# Altium schematic sheet TinyShuffle v.0b.SchDoc
size A2
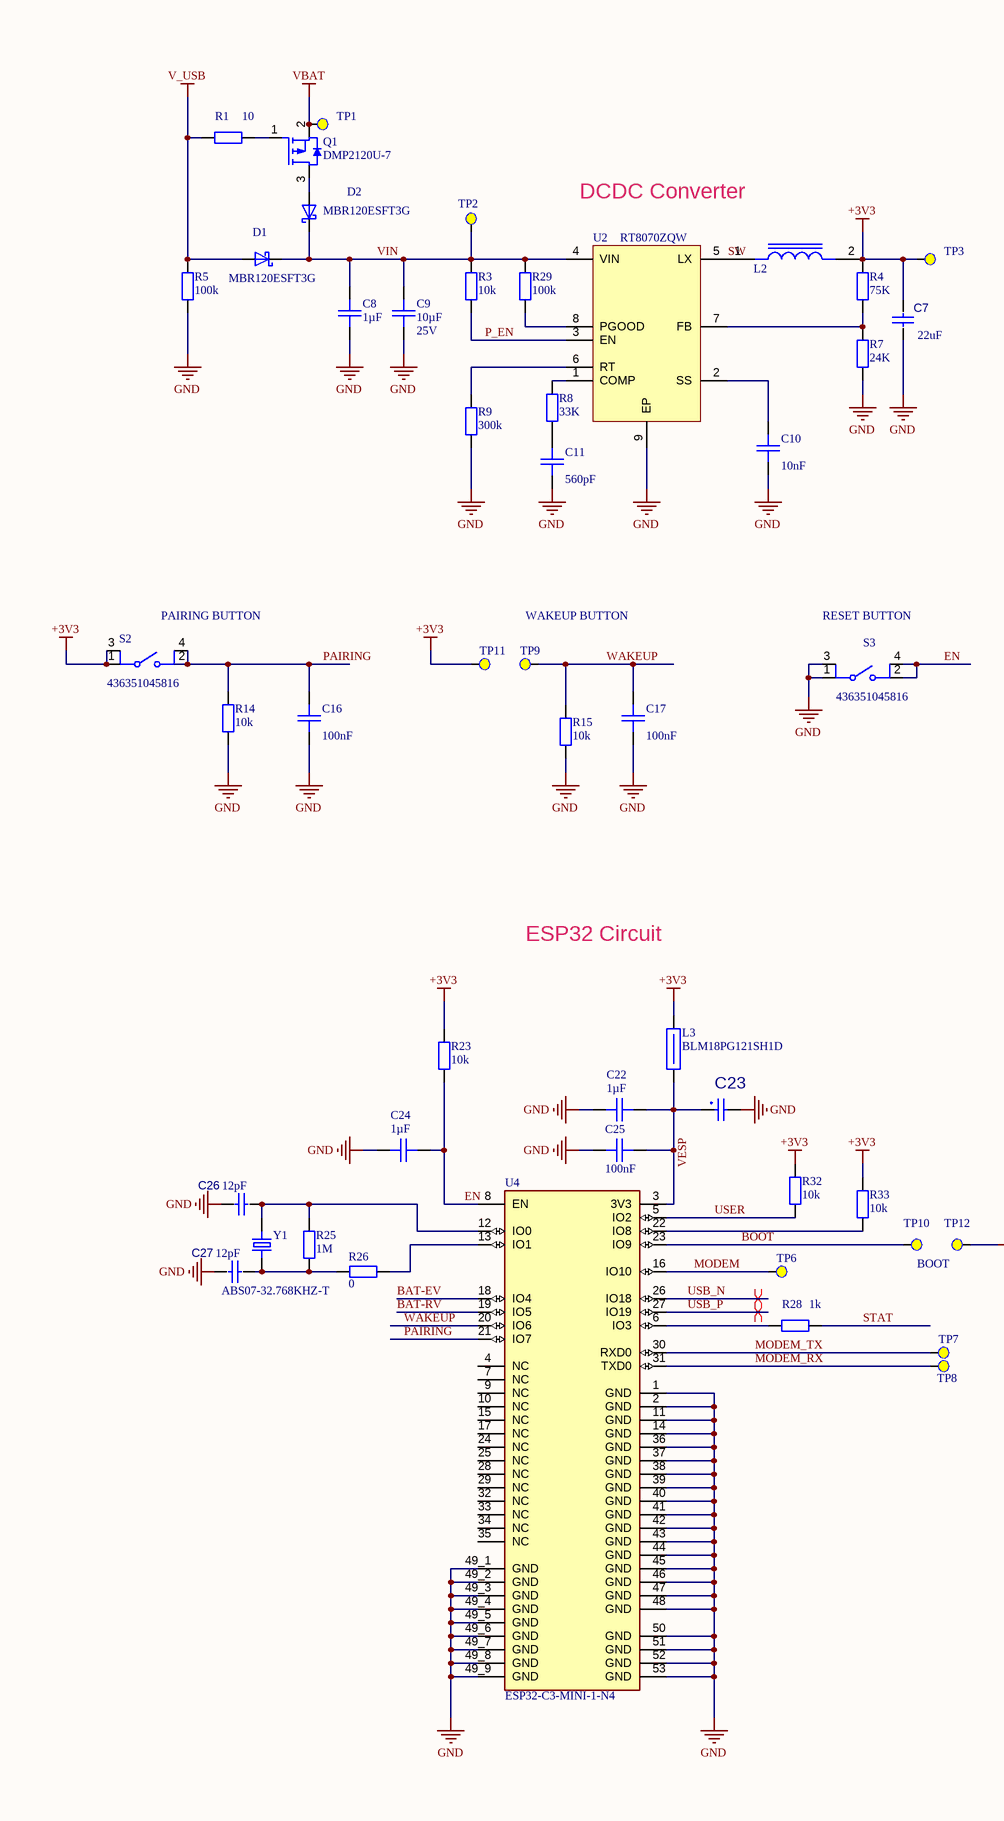
[diagram p0: TinyShuffle v.0b.SchDoc, left]
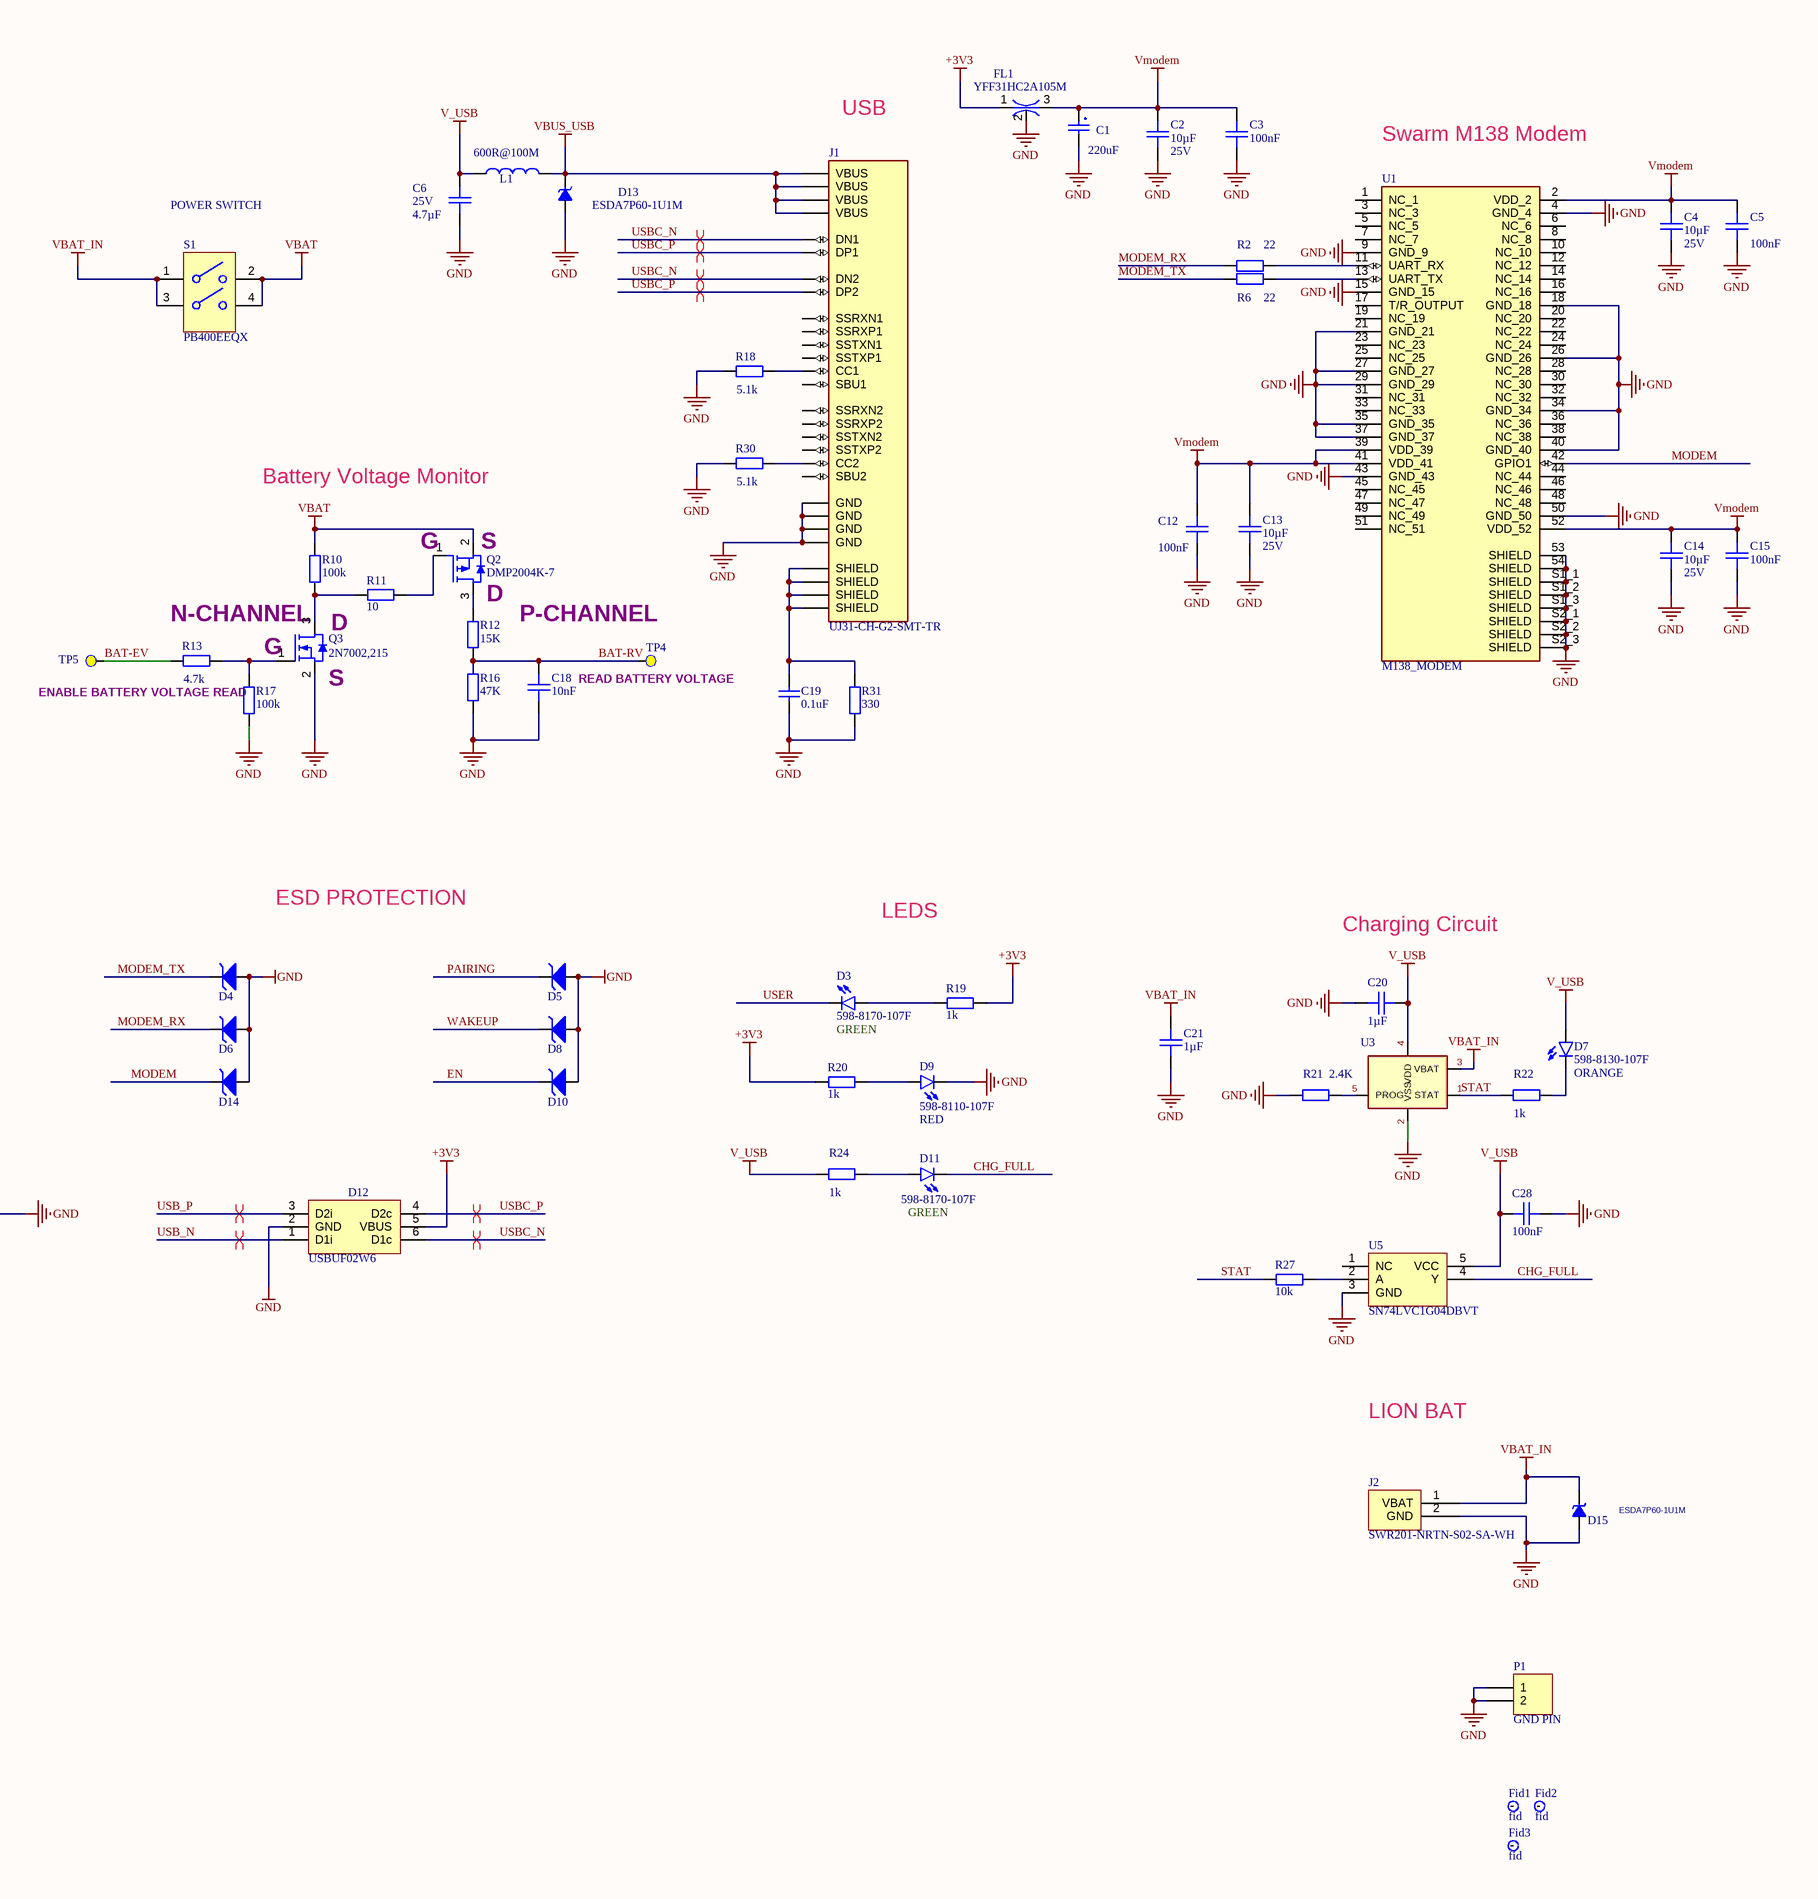
[diagram p1: TinyShuffle v.0b.SchDoc, right]

## Parts
C1  Capacitance: 220uF  [CHEMI-H70]  (hidden comment: APXA6R3ARA221MH7)
C2  Capacitance: 10µF  Voltage Rating: 25V  [CAPC160X80X90L35L]  (hidden comment: GRM188R61E106MA73J)
C3  Capacitance: 100nF  [CAPC160X80X90L35L]  (hidden comment: CL10B104KB8NNWC)
C4  Capacitance: 10µF  Voltage Rating: 25V  [CAPC160X80X90L35L]  (hidden comment: GRM188R61E106MA73J)
C5  Capacitance: 100nF  [CAPC160X80X90L35L]  (hidden comment: CL10B104KB8NNWC)
C6  Voltage Rating: 25V  Capacitance: 4.7µF  [CAPC160X80X90L35L]  (hidden comment: GRM188R61E475KE11D)
C7  value 22uF  [CAPC2012X135N]  (hidden comment: CL21A226MOQNNNE)
C8  Capacitance: 1µF  [CAPC160X80X90L35L]  (hidden comment: CL10A105KA8NNNC)
C9  Capacitance: 10µF  Voltage Rating: 25V  [CAPC160X80X90L35L]  (hidden comment: GRM188R61E106MA73J)
C10  Capacitance: 10nF  [CAPC160X80X90L35L]  (hidden comment: CL10B103KB8NNNC)
C11  Capacitance: 560pF  [CAPC160X80X90L35L]  (hidden comment: CL10C561JB8NFNC)
C12  Capacitance: 100nF  [CAPC160X80X90L35L]  (hidden comment: CL10B104KB8NNWC)
C13  Capacitance: 10µF  Voltage Rating: 25V  [CAPC160X80X90L35L]  (hidden comment: GRM188R61E106MA73J)
C14  Capacitance: 10µF  Voltage Rating: 25V  [CAPC160X80X90L35L]  (hidden comment: GRM188R61E106MA73J)
C15  Capacitance: 100nF  [CAPC160X80X90L35L]  (hidden comment: CL10B104KB8NNWC)
C16  Capacitance: 100nF  [CAPC160X80X90L35L]  (hidden comment: CL10B104KB8NNWC)
C17  Capacitance: 100nF  [CAPC160X80X90L35L]  (hidden comment: CL10B104KB8NNWC)
C18  Capacitance: 10nF  [CAPC160X80X90L35L]  (hidden comment: GCM1885C1H103JA16D)
C19  0.1uF  [0603 CAP]
C20  Capacitance: 1µF  [CAPC160X80X90L35L]  (hidden comment: CL10A105KA8NNNC)
C21  Capacitance: 1µF  [CAPC160X80X90L35L]  (hidden comment: CL10A105KA8NNNC)
C22  Capacitance: 1µF  [CAPC160X80X90L35L]  (hidden comment: CL10A105KA8NNNC)
C23  APXA6R3ARA221MH7  [CHEMI-H70]  (value not drawn)
C24  Capacitance: 1µF  [CAPC160X80X90L35L]  (hidden comment: CL10A105KA8NNNC)
C25  Capacitance: 100nF  [CAPC160X80X90L35L]  (hidden comment: CL10B104KB8NNWC)
C26  value 12pF  [0603 Capacitor]  (hidden comment: GRM1885C1H120JA01J)
C27  value 12pF  [0603 Capacitor]  (hidden comment: GRM1885C1H120JA01J)
C28  Capacitance: 100nF  [CAPC160X80X90L35L]  (hidden comment: CL10B104KB8NNWC)
D1  MBR120ESFT3G  [SODFL3616X98N]
D2  MBR120ESFT3G  [SODFL3616X98N]
D3  598-8170-107F  value GREEN  [LEDC2012X70N]
D4  CDSOD323-T03SC  [SOD2513X120N]  (value not drawn)
D5  CDSOD323-T03SC  [SOD2513X120N]  (value not drawn)
D6  CDSOD323-T03SC  [SOD2513X120N]  (value not drawn)
D7  598-8130-107F  value ORANGE  [LEDC2012X70N]
D8  CDSOD323-T03SC  [SOD2513X120N]  (value not drawn)
D9  598-8110-107F  value RED  [LEDC2012X70N]
D10  CDSOD323-T03SC  [SOD2513X120N]  (value not drawn)
D11  598-8170-107F  value GREEN  [LEDC2012X70N]
D12  USBUF02W6  [SOT323-6L]
D13  ESDA7P60-1U1M  [ST_1610]
D14  CDSOD323-T03SC  [SOD2513X120N]  (value not drawn)
D15  ESDA7P60-1U1M  [ST_1610]
Fid1  fid  [Fiducial mark 1]  (no BOM)
Fid2  fid  [Fiducial mark 1]  (no BOM)
Fid3  fid  [Fiducial mark 1]  (no BOM)
FL1  YFF31HC2A105M  [FIL_YFF31HC2A105M]
J1  UJ31-CH-G2-SMT-TR  [CUI_UJ31-CH-G2-SMT-TR]
J2  SWR201-NRTN-S02-SA-WH  [JST_B2B-PH-K-S(LF)(SN)]
L1  600R@100M  [0805 Ferrite Bead 2012]
L2  SRP4020FA-2R0M  [IND_SRP4020FA-1R0M]  (value not drawn)
L3  BLM18PG121SH1D  [0603 Ferrite Bead 1608]
P1  GND PIN  [HDR1X2]  (no BOM)
Q1  DMP2120U-7  [SOT23-3P95_237X112L50X40L]
Q2  DMP2004K-7  [SOT23-3P95_237X112L50X40L]
Q3  2N7002,215  [SOT23-3P95_237X112L50X40L]
R1  Resistance: 10  [RESC160X80X45L30L]  (hidden comment: RC0603FR-0710RL)
R2  Resistance: 22  [RESC160X80X45L30L]  (hidden comment: RC0603FR-0722RL)
R3  Resistance: 10k  [RESC160X80X45L30L]  (hidden comment: RT0603DRD0710KL)
R4  Resistance: 75K  [RESC160X80X45L30L]  (hidden comment: RC0603FR-0775KL)
R5  Resistance: 100k  [RESC160X80X45L30L]  (hidden comment: RC0603FR-07100KL)
R6  Resistance: 22  [RESC160X80X45L30L]  (hidden comment: RC0603FR-0722RL)
R7  Resistance: 24K  [RESC160X80X45L30L]  (hidden comment: RC0603FR-0724KL)
R8  Resistance: 33K  [RESC160X80X45L30L]  (hidden comment: RC0603FR-0733KL)
R9  Resistance: 300k  [RESC160X80X45L30L]  (hidden comment: RC0603FR-07300KL)
R10  Resistance: 100k  [RESC160X80X45L30L]  (hidden comment: RC0603FR-07100KL)
R11  Resistance: 10  [RESC160X80X45L30L]  (hidden comment: RC0603FR-0710RL)
R12  Resistance: 15K  [RESC160X80X45L30L]  (hidden comment: RC0603FR-0715KL)
R13  Resistance: 4.7k  [RESC160X80X45L30L]  (hidden comment: RC0603FR-074K7P)
R14  Resistance: 10k  [RESC160X80X45L30L]  (hidden comment: RT0603DRD0710KL)
R15  Resistance: 10k  [RESC160X80X45L30L]  (hidden comment: RT0603DRD0710KL)
R16  Resistance: 47K  [RESC160X80X45L30L]  (hidden comment: RC0603FR-0747KL)
R17  Resistance: 100k  [RESC160X80X45L30L]  (hidden comment: RC0603FR-07100KL)
R18  Resistance: 5.1k  [RESC160X80X45L30L]  (hidden comment: RC0603FR-075K1L)
R19  Resistance: 1k  [RESC160X80X45L30L]  (hidden comment: RC0603FR-071KP)
R20  Resistance: 1k  [RESC160X80X45L30L]  (hidden comment: RC0603FR-071KP)
R21  Resistance: 2.4K  [RESC160X80X45L30L]  (hidden comment: RC0603FR-072K4L)
R22  Resistance: 1k  [RESC160X80X45L30L]  (hidden comment: RC0603FR-071KP)
R23  Resistance: 10k  [RESC160X80X45L30L]  (hidden comment: RT0603DRD0710KL)
R24  Resistance: 1k  [RESC160X80X45L30L]  (hidden comment: RC0603FR-071KP)
R25  Resistance: 1M  [RESC160X80X45L30L]  (hidden comment: AC0603FR-071ML)
R26  Resistance: 0  [RESC160X80X45L30L]  (hidden comment: CRCW06030000Z0EA)
R27  Resistance: 10k  [RESC160X80X45L30L]  (hidden comment: RT0603DRD0710KL)
R28  Resistance: 1k  [RESC160X80X45L30L]  (hidden comment: RC0603FR-071KP)
R29  Resistance: 100k  [RESC160X80X45L30L]  (hidden comment: RC0603FR-07100KL)
R30  Resistance: 5.1k  [RESC160X80X45L30L]  (hidden comment: RC0603FR-075K1L)
R31  Resistance: 330  [RESC160X80X45L30L]  (hidden comment: RC0603FR-07330RL)
R32  Resistance: 10k  [RESC160X80X45L30L]  (hidden comment: RT0603DRD0710KL)
R33  Resistance: 10k  [RESC160X80X45L30L]  (hidden comment: RT0603DRD0710KL)
S1  PB400EEQX  [SW_PB400EEQX]
S2  436351045816  [436351045816]
S3  436351045816  [436351045816]
TP1  TPAD  [PAD_2.0R]  (value not drawn)  (no BOM)
TP2  TPAD  [PAD_2.0R]  (value not drawn)  (no BOM)
TP3  TPAD  [PAD_2.0R]  (value not drawn)  (no BOM)
TP4  TPAD  [PAD_2.0R]  (value not drawn)  (no BOM)
TP5  TPAD  [PAD_2.0R]  (value not drawn)  (no BOM)
TP6  TPAD  [PAD_2.0R]  (value not drawn)  (no BOM)
TP7  TPAD  [PAD_2.0R]  (value not drawn)  (no BOM)
TP8  TPAD  [PAD_2.0R]  (value not drawn)  (no BOM)
TP9  TPAD  [PAD_2.0R]  (value not drawn)  (no BOM)
TP10  TPAD  [PAD_2.0R]  (value not drawn)  (no BOM)
TP11  TPAD  [PAD_2.0R]  (value not drawn)  (no BOM)
TP12  TPAD  [PAD_2.0R]  (value not drawn)  (no BOM)
U1  M138_MODEM  [XCVR_M138_MODEM]
U2  RT8070ZQW  [QFN65P300X300X80_HS-9L]
U3  MCP73831T-2ACI/OT  [SOT95P270X145-5N]  (value not drawn)
U4  ESP32-C3-MINI-1-N4  [XCVR_ESP32-C3-MINI-1-N4]
U5  SN74LVC1G04DBVT  [SOT95P270X145-5N]
Y1  ABS07-32.768KHZ-T  [XTAL_ABS07-32.768KHZ-T]

## Nets
+3V3: C7.2 D12.5(VBUS) FL1.1(IN/OUT) L2.2 L3.2 R4.1 R19.1 R20.1 R23.2 R32.2 R33.2 S2.1 S2.3 TP3.1(TPoint) TP11.1(TPoint)
GND: C1.2 C2.1 C3.1 C4.1 C5.1 C6.1 C7.1 C8.2 C9.1 C10.1 C11.1 C12.2 C13.1 C14.1 C15.1 C16.1 C17.1 C18.1 C19.2 C20.2 C21.2 C22.2 C23.2 C24.2 C25.2 C26.2 C27.2 C28.1 D4.A D5.A D6.A D8.A D9.C D10.A D12.2(GND) D13.2(A) D14.A D15.2(A) FL1.2 J1.A1(GND) J1.A12(GND) J1.B1(GND) J1.B12(GND) J2.2(GND) P1.1 P1.2 Q3.2 R5.1 R7.2 R9.1 R14.1 R15.1 R16.2 R17.1 R18.1 R21.1 R30.1 R31.1 S3.1 S3.3 TP12.1(TPoint) U1.4(GND_4) U1.9(GND_9) U1.15(GND_15) U1.18(GND_18) U1.21(GND_21) U1.26(GND_26) U1.27(GND_27) U1.29(GND_29) U1.34(GND_34) U1.35(GND_35) U1.37(GND_37) U1.40(GND_40) U1.43(GND_43) U1.50(GND_50) U1.53(SHIELD) U1.54(SHIELD) U1.S1_1(SHIELD) U1.S1_2(SHIELD) U1.S1_3(SHIELD) U1.S2_1(SHIELD) U1.S2_2(SHIELD) U1.S2_3(SHIELD) U2.9(EP) U3.2(VSS) U4.1(GND) U4.2(GND) U4.11(GND) U4.14(GND) U4.36(GND) U4.37(GND) U4.38(GND) U4.39(GND) U4.40(GND) U4.41(GND) U4.42(GND) U4.43(GND) U4.44(GND) U4.45(GND) U4.46(GND) U4.47(GND) U4.48(GND) U4.49_1(GND) U4.49_2(GND) U4.49_3(GND) U4.49_4(GND) U4.49_5(GND) U4.49_6(GND) U4.49_7(GND) U4.49_8(GND) U4.49_9(GND) U4.50(GND) U4.51(GND) U4.52(GND) U4.53(GND) U5.3(GND)
V_USB: C6.2 C20.1 C28.2 D1.1(A) D7.A L1.1 R1.1 R5.2 R24.1 U3.4(VDD) U5.5(VCC)
VBAT: Q1.2 Q2.2 R10.2 S1.2 S1.4 TP1.1(TPoint)
VBAT_IN: C21.1 D15.1(K) J2.1(VBAT) S1.1 S1.3 U3.3(VBAT)
VBUS_USB: D13.1(K) J1.A4(VBUS) J1.A9(VBUS) J1.B4(VBUS) J1.B9(VBUS) L1.2
Vmodem: C1.1 C2.2 C3.2 C4.2 C5.2 C12.1 C13.2 C14.2 C15.2 FL1.3(OUT/IN) U1.2(VDD_2) U1.39(VDD_39) U1.41(VDD_41) U1.52(VDD_52)
BAT-EV: R13.1 TP5.1(TPoint) U4.18(IO4)
BAT-RV: C18.2 R12.1 R16.1 TP4.1(TPoint) U4.19(IO5)
BOOT: TP10.1(TPoint) U4.23(IO9)
CHG_FULL: D11.C U5.4(Y)
EN: C24.1 D10.K R23.1 S3.2 S3.4 U4.8(EN)
MODEM: D14.K TP6.1(TPoint) U1.42(GPIO1) U4.16(IO10)
MODEM_RX: D6.K R2.1 TP8.1(TPoint) U4.31(TXD0)
MODEM_TX: D4.K R6.1 TP7.1(TPoint) U4.30(RXD0)
P_EN: R3.1 U2.3(EN)
PAIRING: C16.2 D5.K R14.2 S2.2 S2.4 U4.21(IO7)
STAT: R22.1 R27.1 R28.2 U3.1(STAT)
SW: L2.1 U2.5(LX)
USB_N: D12.1(D1i) U4.26(IO18)
USB_P: D12.3(D2i) U4.27(IO19)
USBC_N: D12.6(D1c) J1.A7(DN1) J1.B7(DN2)
USBC_P: D12.4(D2c) J1.A6(DP1) J1.B6(DP2)
USER: D3.C R32.1 U4.5(IO2)
VESP: C22.1 C23.1 C25.1 L3.1 U4.3(3V3)
VIN: C8.1 C9.2 D1.2(K) D2.2(K) R3.2 R29.2 TP2.1(TPoint) U2.4(VIN)
WAKEUP: C17.2 D8.K R15.2 TP9.1(TPoint) U4.20(IO6)
NetC10_2: C10.2 U2.2(SS)
NetC11_2: C11.2 R8.1
NetC19_1: C19.1 J1.SH1(SHIELD) J1.SH2(SHIELD) J1.SH3(SHIELD) J1.SH4(SHIELD) R31.2
NetC26_1: C26.1 R25.2 U4.12(IO0) Y1.2
NetC27_1: C27.1 R25.1 R26.1 Y1.1
NetD2_1: D2.1(A) Q1.3
NetD3_A: D3.A R19.2
NetD7_C: D7.C R22.2
NetD9_A: D9.A R20.2
NetD11_A: D11.A R24.2
NetJ1_A5: J1.A5(CC1) R18.2
NetJ1_B5: J1.B5(CC2) R30.2
NetQ1_1: Q1.1 R1.2
NetQ2_1: Q2.1 R11.1
NetQ2_3: Q2.3 R12.2
NetQ3_1: Q3.1 R13.2 R17.2
NetQ3_3: Q3.3 R10.1 R11.2
NetR2_2: R2.2 U1.11(UART_RX)
NetR4_2: R4.2 R7.1 U2.7(FB)
NetR6_2: R6.2 U1.13(UART_TX)
NetR8_2: R8.2 U2.1(COMP)
NetR9_2: R9.2 U2.6(RT)
NetR21_2: R21.2 U3.5(PROG)
NetR26_2: R26.2 U4.13(IO1)
NetR27_2: R27.2 U5.2(A)
NetR28_1: R28.1 U4.6(IO3)
NetR29_1: R29.1 U2.8(PGOOD)
NetR33_1: R33.1 U4.22(IO8)

Not connected (* = marked no-connect by the designer): Fid1 0; Fid2 0; Fid3 0; J1 A2(SSTXP1) A3(SSTXN1) A8(SBU1) A10(SSRXN2) A11(SSRXP2) B2(SSTXP2) B3(SSTXN2) B8(SBU2) B10(SSRXN1) B11(SSRXP1); U1 1(NC_1) 3(NC_3) 5(NC_5) 6(NC_6) 7(NC_7) 8(NC_8) 10(NC_10) 12(NC_12) 14(NC_14) 16(NC_16) 17(T/R_OUTPUT) 19(NC_19) 20(NC_20) 22(NC_22) 23(NC_23) 24(NC_24) 25(NC_25) 28(NC_28) 30(NC_30) 31(NC_31) 32(NC_32) 33(NC_33) 36(NC_36) 38(NC_38) 44(NC_44) 45(NC_45) 46(NC_46) 47(NC_47) 48(NC_48) 49(NC_49) 51(NC_51); U4 4(NC) 7(NC) 9(NC) 10(NC) 15(NC) 17(NC) 24(NC) 25(NC) 28(NC) 29(NC) 32(NC) 33(NC) 34(NC) 35(NC); U5 1(NC)

## Layout directives
differential pair; differential pair class USB: USB_N, USB_P, USBC_N, USBC_P

## Notes on the sheet
- USB
- Swarm M138 Modem
- DCDC Converter
- POWER SWITCH
- Battery Voltage Monitor
- (near S2) PAIRING BUTTON
- WAKEUP BUTTON
- (near S3) RESET BUTTON
- (near Q2) G
- (near Q2) S
- D
- N-CHANNEL
- G
- (near Q3) D
- P-CHANNEL
- ENABLE BATTERY VOLTAGE READ
- (near Q3) S
- (near TP4) READ BATTERY VOLTAGE
- ESP32 Circuit
- ESD PROTECTION
- LEDS
- Charging Circuit
- BOOT
- LION BAT
- DWG NO:
- REV:
- THIS DOCUMENT AND THE DATA DISCLOSED HEREIN OR
- HEREWITH IS THE PROPERTY OF ALTIUM LIMITED AND MAY
- BE FREELY DISTRIBUTED IN WHOLE. NO RIGHTS ARE
- RESERVED OR EXPRESS OR IMPLIED WARANTEE GIVEN.
- REVISION
- DESCRIPTION
- DATE
- APPROVED
- ENG:
- APPROVALS
- PROJECT
- DSN:
- CHK:
- REFERENCE DOCUMENTS
- PROJECT REVISION:
- TITLE
- DOCUMENT REVISION:
- DESIGN ITEM:
- BOM:
- FAB DWG:
- PCB DWG:
- ASSY DWG:
- SCALE:
- A2
- SIZE
- CAGE CODE
- FILE NAME
- DWG NO.
- SHEET
- OF
- REV

## Library data of the parts
C1 C23 = APXA6R3ARA221MH7: CAP ALUM POLY 220UF 20% 6.3V SMD; Manufacturer: Nippon Chemi-Con; MPN: APXA6R3ARA221MH70G; Voltage Rating: 6.3V; Tolerance:: 20%
  C23: Capacitance: 220uF
C2 C4 C9 C13 C14 = CMP-00444-2: CAP CER 10UF 25V X5R 0603; Manufacturer: Murata Electronics; Op Temp min: -55°C; Op Temp max: 85°C; Tolerance: 20%; Lead Spacing: 0mm; ComponentLink3URL: https://www.digikey.com/en/products/detail/murata-electronics/GRM188R61E106MA73J/4905347?s=N4IgTCBcDaIOICUCyBGAHGhA2FBRFADFkgIIDsAzAFIgC6AvkA; Mounting Type: SM; Package: 0603 (1608 Metric); Ratings: -; Size: 1.60mm x 0.80mm; ComponentLink3Description: Digikey; ComponentLink1Description: Datasheet; ComponentLink2URL: https://eu.mouser.com/ProductDetail/Murata-Electronics/GRM188R61E106MA73J?qs=hNud%2FORuBR2%252B%252BY67hhW1nA%3D%3D; ComponentLink2Description: Mouser; ComponentLink1URL: https://www.murata.com/en-global/products/productdetail?partno=GRM188R61E106MA73%23; MPN: GRM188R61E106MA73J; Dielectric: X5R; Height max: 1mm
C3 C5 C12 C15 C17 C25 C28 = CMP-00119-2: CAP CER 0.1UF 50V X7R 0603; Manufacturer: Samsung Electro-Mechanics; Op Temp min: -55°C; Tolerance: 10%; Op Temp max: 125°C; Voltage Rating: 50V; ComponentLink3URL: https://www.digikey.com/en/products/detail/samsung-electro-mechanics/CL10B104KB8NNWC/3887593; Dielectric: X7R; Ratings: -; Size: 1.60mm x 0.80mm; ComponentLink1Description: Datasheet; ComponentLink2Description: Mouser; ComponentLink3Description: Digikey; ComponentLink1URL: http://product.samsungsem.com/mlcc/CL10B104KB8NNW.do; ComponentLink2URL: https://eu.mouser.com/ProductDetail/Samsung-Electro-Mechanics/CL10B104KB8NNWC?qs=%2Fha2pyFaduh3vwrZSGoh3Z6Gj3oVa1Y%2Fpd7iGPjF01jpt%2F6TY3kdMw%3D%3D; MPN: CL10B104KB8NNWC; Package: 0603 (1608 Metric); Mounting Type: SM; Height max: 900µm; Lead Spacing: 0mm
C6 = CMP-001-0280-2: CAP CER 4.7UF 25V X5R 0603; Manufacturer: Murata Electronics; Tolerance: 10%; Op Temp max: 85°C; Op Temp min: -55°C; Lead Spacing: 0mm; ComponentLink1URL: https://www.murata.com/-/media/webrenewal/support/library/catalog/products/capacitor/ceramiccapacitor/c02e.ashx?la=en-us&cvid=20210120024548000000; ComponentLink2URL: https://eu.mouser.com/ProductDetail/Murata-Electronics/GRM188R61E475KE11D?qs=eeBpzGFlv%252B9M0HqzMo%2FgYw%3D%3D; ComponentLink2Description: Mouser; Size: 1.60mm x 0.80mm; Dielectric: X5R; Package: 0603 (1608 Metric); ComponentLink1Description: Datasheet; ComponentLink3URL: https://www.digikey.com/en/products/detail/murata-electronics/GRM188R61E475KE11D/3900465; Ratings: -; Mounting Type: SM; Height max: 800µm; MPN: GRM188R61E475KE11D; ComponentLink3Description: Digikey
C7 = CL21A226MOQNNNE: CAP CER 22UF 16V X5R 0805; Manufacturer: Samsung Electro-Mechanics; Tolerance: ±20%; MPN: CL21A226MOQNNNE; Voltage - Rated: 16V; Temperature Coefficient: X5R; Operating Temperature: -55°C ~ 85°C; Package / Case: 0805 (2012 Metric); ComponentLink1Description: Datasheet; ComponentLink1URL: https://media.digikey.com/pdf/Data%20Sheets/Samsung%20PDFs/CL21A226MOQNNNE_Spec.pdf; ComponentLink2Description: Digikey; ComponentLink2URL: https://www.digikey.com/en/products/detail/samsung-electro-mechanics/CL21A226MOQNNNE/3888567
C8 C20-C22 C24 = CMP-001-0243-7: CAP CER 1UF 25V X5R 0603; Manufacturer: Samsung Electro-Mechanics; Op Temp min: -55°C; Tolerance: 10%; Op Temp max: 125°C; MPN: CL10A105KA8NNNC; ComponentLink3Description: Digikey; ComponentLink3URL: https://www.digikey.com/en/products/detail/samsung-electro-mechanics/CL10A105KA8NNNC/3886760; Height max: 900µm; ComponentLink1Description: Datasheet; Ratings: -; ComponentLink2Description: Mouser; ComponentLink1URL: https://media.digikey.com/pdf/Data%20Sheets/Samsung%20PDFs/CL10A105KA8NNNC_Spec.pdf; Voltage Rating: 25V; ComponentLink2URL: https://eu.mouser.com/ProductDetail/Samsung-Electro-Mechanics/CL10A105KA8NNNC?qs=hqM3L16%252BxldY%252BnK4KzDJVg%3D%3D; Package: 0603 (1608 Metric); Mounting Type: SM; Dielectric: X5R; Lead Spacing: 0mm; Size: 1.60mm x 0.80mm
C10 = CMP-00119-2: CAP CER 10000PF 50V X7R 0603; Manufacturer: Samsung Electro-Mechanics; Op Temp min: -55°C; Tolerance: 10%; Op Temp max: 125°C; Voltage Rating: 50V; ComponentLink3URL: https://www.digikey.com/en/products/detail/samsung-electro-mechanics/CL10B103KB8NNNC/3886667; Dielectric: X7R; Ratings: -; Size: 1.60mm x 0.80mm; ComponentLink1Description: Datasheet; ComponentLink2Description: Mouser; ComponentLink3Description: Digikey; ComponentLink1URL: https://media.digikey.com/pdf/Data%20Sheets/Samsung%20PDFs/CL10B103KB8NNNC_Spec.pdf; ComponentLink2URL: https://www.mouser.com/ProductDetail/Samsung-Electro-Mechanics/CL10B103KB8NNNC?qs=349EhDEZ59pAsZxZjVI0UQ%3D%3D; MPN: CL10B103KB8NNNC; Package: 0603 (1608 Metric); Mounting Type: SM; Height max: 900µm; Lead Spacing: 0mm
C11 = CMP-00119-2: CAP CER 560PF 50V C0G/NP0 0603; Manufacturer: Samsung Electro-Mechanics; Op Temp min: -55°C; Dielectric: C0G, NP0; Tolerance: 10%; Op Temp max: 125°C; Voltage Rating: 50V; ComponentLink3URL: https://www.digikey.com/en/products/detail/samsung-electro-mechanics/CL10C561JB8NFNC/3887973; Ratings: -; Size: 1.60mm x 0.80mm; ComponentLink1Description: Datasheet; ComponentLink2Description: Mouser; ComponentLink3Description: Digikey; ComponentLink1URL: https://www.samsungsem.com/kr/support/product-search/mlcc/CL10C561JB8NFNC.jsp; ComponentLink2URL: https://www.mouser.com/ProductDetail/Samsung-Electro-Mechanics/CL10C561JB8NFNC?qs=h6Piwd%2Fnvzm6ky5tL0eH4g%3D%3D; MPN: CL10C561JB8NFNC; Package: 0603 (1608 Metric); Mounting Type: SM; Height max: 900µm; Lead Spacing: 0mm
C16 = CMP-00119-3: CAP CER 0.1UF 50V X7R 0603; Manufacturer: Samsung Electro-Mechanics; Op Temp min: -55°C; Tolerance: 10%; Op Temp max: 125°C; Voltage Rating: 50V; ComponentLink3URL: https://www.digikey.com/en/products/detail/samsung-electro-mechanics/CL10B104KB8NNWC/3887593; Dielectric: X7R; Ratings: -; Size: 1.60mm x 0.80mm; ComponentLink1Description: Datasheet; ComponentLink2Description: Mouser; ComponentLink3Description: Digikey; ComponentLink1URL: http://product.samsungsem.com/mlcc/CL10B104KB8NNW.do; ComponentLink2URL: https://eu.mouser.com/ProductDetail/Samsung-Electro-Mechanics/CL10B104KB8NNWC?qs=%2Fha2pyFaduh3vwrZSGoh3Z6Gj3oVa1Y%2Fpd7iGPjF01jpt%2F6TY3kdMw%3D%3D; Package: 0603 (1608 Metric); Mounting Type: SM; Height max: 900µm; Lead Spacing: 0mm; MPN: CL10B104KB8NNWC
C18 = CMP-001-0433-1: CAP CER 10000PF 50V NP0 0603; Manufacturer: Murata Electronics; Op Temp max: 125°C; Tolerance: 5%; Dielectric: NP0 (C0G); Op Temp min: -55°C; Mounting Type: SM; Size: 1.60mm x 0.80mm; Height max: 900µm; ComponentLink2Description: Mouser; ComponentLink3Description: Digikey; MPN: GCM1885C1H103JA16D; Ratings: AEC-Q200; ComponentLink1URL: https://www.murata.com/en-global/products/productdetail?partno=GCM1885C1H103JA16%23; ComponentLink1Description: Datasheet; Lead Spacing: 0mm; ComponentLink2URL: https://eu.mouser.com/ProductDetail/Murata-Electronics/GCM1885C1H103JA16D?qs=d0WKAl%252BL4KaCN8KV5xEifw%3D%3D; Package: 0603 (1608 Metric); ComponentLink3URL: https://www.digikey.com/en/products/detail/murata-electronics/GCM1885C1H103JA16D/13401923; Voltage Rating: 50V
C19 = 0603-X7R-100V-0.1uF: CAP CER 0.1UF 100V X7R 0603; Manufacturer: Samsung; MPN: CL10B104KC8NNNC; Group: Ceramic capacitor, SMD; Supplier 1: DigiKey; Value: 0.1uF; Price: 0.01625; Supplier 1 Link: https://www.digikey.com/product-detail/en/samsung-electro-mechanics/CL10B104KC8NNNC/1276-6807-2-ND/5961291; Supplier 1 Part Number: 1276-6807-2-ND; Package/Case: 0603 (1608 Metric)
C26 C27 = CAPC1608N-0.1UF: CAP CER 12PF NP0 0603; Manufacturer: Murata Electronics; MPN: GRM1885C1H120JA01J
D1 D2 = MBR0520: DIODE SCHOTTKY 20V 1A SOD123FL; Generic Part: no; Manufacturer: ON; MPN: MBR120ESFT3G; Footprint: Diode_SMD:D_SOD-123; LCSC Part Number: C81143
D3 D11 = 598_SERIES_LED: Green 566nm LED Indication - Discrete 2V 0805 (2012 Metric); Manufacturer: Dialight; MPN: 598-8170-107F; SnapEDA_Link: https://www.snapeda.com/parts/598-8110-107F/Dialight/view-part/275124/?ref=snap; Price: None; Package: 0805 Dialight; Availability: Unavailable
D4-D6 D8 D10 D14 = CDSOD323-T03SC: TVS DIODE 3.3VWM 10.9VC SOD323; Manufacturer: Bourns Inc.; Voltage - Reverse Standoff (Typ): 3.3V; Voltage - Breakdown (Min): 4V; Voltage - Clamping (Max) @ Ipp: 10.9V (Typ); Current - Peak Pulse (10/1000µs): 43A (8/20µs); Capacitance @ Frequency: 200pF @ 1MHz; MPN: CDSOD323-T03SC; ComponentLink1Description: Datasheet; ComponentLink1URL: https://www.mccsemi.com/pdf/Products/ESDLC3V3D3~ESDLC12VD3(SOD-323).pdf; ComponentLink2Description: Digikey; ComponentLink2URL: https://www.digikey.com/en/products/detail/micro-commercial-co/ESDLC3V3D3-TP/2512797; ComponentLink3Description: Mouser; ComponentLink3URL: https://eu.mouser.com/ProductDetail/Micro-Commercial-Components-MCC/ESDLC3V3D3-TP?qs=tWhVDKcjDQFO%252BZgFf6OwKw%3D%3D
D7 = 598_SERIES_LED: Orange 605nm LED Indication - Discrete 2V 0805 (2012 Metric); Manufacturer: Dialight; MPN: 598-8130-107F; Package: 0805 Dialight; Availability: Unavailable
D9 = 598_SERIES_LED: Red 635nm LED Indication - Discrete 2.2V 0805 _2012 Metric_; Manufacturer: Dialight; MPN: 598-8110-107F; SnapEDA_Link: https://www.snapeda.com/parts/598-8110-107F/Dialight/view-part/275124/?ref=snap; Price: None; Package: 0805 Dialight; Availability: Unavailable
D12 = NUF2221W1T2G: FILTER RC(PI) 22 OHM/47PF SMD; Manufacturer: STMicroelectronics; Group: Diode; MPN: USBUF02W6; Value: USBUF02W6; Supplier 1 Link: https://www.digikey.com/en/products/detail/stmicroelectronics/USBUF02W6/686422; Supplier 1 Part Number: 497-3743-2-ND; Supplier 1: Digi-Key; Price: 0.8; Package/Case: SOT363
D13 D15 = ESDA7P60-1U1M: TVS DIODE 5V 11.6V 1610; Manufacturer: STMicroelectronics; Group: Diode; MPN: ESDA7P60-1U1M; Supplier 1: Digi-Key; Supplier 1 Link: https://www.digikey.com/en/products/detail/stmicroelectronics/ESDA7P60-1U1M/5768408?s=N4IgTCBcDaIKIGUAiBBA7ABQGwAYC0AjAKoECyIAugL5A; Supplier 1 Part Number: 497-16253-2-ND; Value: ESDA7P60-1U1M; Price: 0.07875; Package/Case: 1610
FL1 = YFF31HC2A105M: 1ÂµF Feed Through Capacitor 100V 6A 5mOhm 1206 (3216 Metric), 4 PC Pad; Manufacturer: TDK; MPN: YFF31HC2A105M; Package: 0402 TDK; SnapEDA_Link: https://www.snapeda.com/parts/YFF31HC2A105M/TDK/view-part/566442/?ref=snap; Value: *; Check_prices: https://www.snapeda.com/parts/YFF31HC2A105M/TDK/view-part/566442/?ref=eda; Purchase-URL: https://pricing.snapeda.com/search/part/YFF31HC2A105M/?ref=eda; Digi-Key_Part_Number: 445-16151-1-ND
J1 = UJ31-CH-G2-SMT-TR: Type C, USB 3.1 Gen 2, 5 A, Right Angle, Surface Mount _SMT_, USB Receptacle; Manufacturer: CUI Devices; MPN: UJ31-CH-G2-SMT-TR
J2 = Battery Connector: Connector Header, PH Series, 2 Position, 2.00mm, Through Hole, Press-Fit, Solder, Natural; Manufacturer: Sullins Connector Solutions; MPN: SWR201-NRTN-S02-SA-WH
L1 = ILHB0805ER601V: FERRITE BEAD 600 OHM 0805 2A; Manufacturer: Vishay Dale; Group: Inductors; Value: 600R; Supplier 1: DigiKey; MPN: ILHB0805ER601V; Price: 0.03040; Supplier 1 Link: https://www.digikey.com/en/products/detail/vishay-dale/ILHB0805ER601V/2575021; Supplier 1 Part Number: 541-2302-2-ND; Package/Case: 0805 (2012 Metric)
L2 = SRP4020FA-2R0M: 2 µH Shielded Drum Core, Wirewound Inductor 8.2 A 23.3mOhm Max Nonstandard -; Manufacturer: Bourns Inc.; Tolerance: 20%; Current Rating (Amps): 8.2 A; Current - Saturation (Isat): 4А; Q @ Freq: 15 @ 100kHz; Frequency - Self Resonant: 40MHz; Package: Nonstandard Bourns Inc.; MPN: SRP4020FA-2R0M; DC Resistance (DCR), Max: 23.3mOhm; Operating Temperature: -55°C ~ 155°C; Parameter 1: *
L3 = ferrite bead: FERRITE BEAD 120 OHM 0603 1LN; Manufacturer: Murata Electronics North America; Supplier 2 Part Number: 81-BLM18PG121SH1D; Supplier 2 Link: https://eu.mouser.com/ProductDetail/Murata-Electronics/BLM18PG121SH1D?qs=%2fha2pyFaduiel0%2fVgJ%252brELM19JMXTESGH14ASLXzLyb4MmtpyhCVjQ%3d%3d; Supplier 1 Part Number: 490-7815-1-ND; Supplier 1 Link: https://www.digikey.com/product-detail/en/murata-electronics-north-america/BLM18PG121SH1D/490-7815-1-ND/4380154; Package: 0603; MPN: BLM18PG121SH1D
P1 = Header 2: Header, 2-Pin; LatestRevisionDate: 17-Jul-2002; LatestRevisionNote: Re-released for DXP Platform.; Publisher: Altium Limited
Q1 = CMP-001-0218-5: MOSFET P-CH 20V 3.8A SOT23; Manufacturer: Diodes Incorporated; Vgs: 2V @ 250µA; Vgs (MAX): ±8V; Rds @ Id, Vgs: 62mOhm @ 4.2A, 4.5V; Op Temp min: -55°C; FET Type: P-Channel; Pmax: 800mW (Ta); Input Capacitance (Ciss) (Max) @ Vds: 487pF @20V; Current - Continuous Drain (Id) @ 25°C: 3.8A (Ta); Op Temp max: 150°C; Package: SOT-23-3; ComponentLink3URL: https://www.digikey.com/en/products/detail/diodes-incorporated/DMP2120U-7/8275357; ComponentLink1Description: Datasheet; Mounting Type: SM; Technology: MOSFET; Height max: 1.12mm; MPN: DMP2120U-7; Drain to Source Voltage (Vdss): 20 V; ComponentLink3Description: Digikey; ComponentLink2URL: https://eu.mouser.com/ProductDetail/Vishay-Semiconductors/SI2325DS-T1-E3?qs=jcx%252B0HVgj2ZrYzLJS1OITQ%3D%3D; Size: 2.9x2.3; ComponentLink2Description: Mouser; ComponentLink1URL: https://www.vishay.com/docs/73238/73238.pdf
Q2 = CMP-001-0218-5: MOSFET P-CH 20V 600MA SOT23-3; Manufacturer: Diodes Incorporated; Vgs: 1V @ 250µA; Vgs (MAX): ±8V; Rds @ Id, Vgs: 900mOhm @ 430mA, 4.5V; Op Temp min: -55°C; FET Type: P-Channel; Pmax: 225mW; Input Capacitance (Ciss) (Max) @ Vds: 175 pF @ 16 V; Op Temp max: 150°C; Package: SOT-23-3; ComponentLink3URL: https://www.digikey.com/en/products/detail/diodes-incorporated/DMP2004K-7/1774201; ComponentLink1Description: Datasheet; Mounting Type: SM; Technology: MOSFET; Height max: 1.12mm; MPN: DMP2004K-7; Drain to Source Voltage (Vdss): 20 V; ComponentLink3Description: Digikey; ComponentLink2URL: https://www.mouser.com/ProductDetail/Diodes-Incorporated/DMP2004K-7?qs=R%252By5Lqt1H6xpbz%252B9t5zMtA%3D%3D; Size: 2.9x2.3; ComponentLink2Description: Mouser; Current - Continuous Drain (Id) @ 25°C: 600mA; ComponentLink1URL: https://www.diodes.com/assets/Datasheets/ds30933.pdf
Q3 = CMP-001-0268-1: Power MOSFET, N Channel, 60 V, 300 mA, 2.8 ohm, SOT-23, Surface Mount; Manufacturer: Nexperia USA Inc.; Op Temp max: 150°C; Current - Continuous Drain (Id) @ 25°C: 360mA; Drain to Source Voltage (Vdss): 60V; FET Type: N-Channel; Input Capacitance (Ciss) (Max) @ Vds: 50 pF @ 10 V; Pmax: 350mW; Op Temp min: -55°C; Rds @ Id, Vgs: 1.6Ohm @ 500mA, 10V; Vgs (MAX): 20; Vgs: 2.4V; ComponentLink1URL: https://assets.nexperia.com/documents/data-sheet/2N7002P.pdf; Size: 2.9x2.3; ComponentLink1Description: Datasheet; ComponentLink2Description: Mouser; Mounting Type: SM; ComponentLink2URL: https://eu.mouser.com/ProductDetail/Nexperia/2N7002P235?qs=A1cBxND5mHJjAcok1kSTYw%3D%3D; Height max: 1.1mm; Package: SOT-23-3; MPN: 2N7002,215; Technology: MOSFET; ComponentLink3Description: Digikey; ComponentLink3URL: https://www.digikey.com/en/products/detail/nexperia-usa-inc/2N7002-215/762973
R1 R11 = CMP-001-0437-1: RES 10 OHM 1% 1/10W 0603; Manufacturer: YAGEO; Temperature Coefficient: ±200ppm/°C; Power: 100mW; Op Temp max: 155°C; Op Temp min: -55°C; Ratings: -; ComponentLink2URL: https://eu.mouser.com/ProductDetail/YAGEO/RC0603FR-0710RL?qs=womCuNp6NjhtCUybQ%252B6d6w%3D%3D; Size: 1.60mm x 0.80mm; MPN: RC0603FR-0710RL; ComponentLink1Description: Datasheet; Mounting Type: SM; Composition: Thick Film; ComponentLink3Description: Digikey; Package: 0603 (1608 Metric); ComponentLink2Description: Mouser; Tolerance: 1%; Height max: 550µm; ComponentLink3URL: https://www.digikey.com/en/products/detail/yageo/RC0603FR-0710RL/726879; ComponentLink1URL: https://www.yageo.com/upload/media/product/productsearch/datasheet/rchip/PYu-RC_Group_51_RoHS_L_11.pdf
R2 R6 = CMP-001-0437-1: RES 22 OHM 1% 1/10W 0603; Manufacturer: YAGEO; Temperature Coefficient: ±150ppm; Power: 100mW; Op Temp max: 155°C; Op Temp min: -55°C; Ratings: -; ComponentLink2URL: https://eu.mouser.com/ProductDetail/YAGEO/RC0603FR-0722RL?qs=diQw95jMAeMOsxb8bne7fg%3D%3D; Size: 1.60mm x 0.80mm; MPN: RC0603FR-0722RL; ComponentLink1Description: Datasheet; Mounting Type: SM; Composition: Thick Film; ComponentLink3Description: Digikey; Package: 0603 (1608 Metric); ComponentLink2Description: Mouser; Tolerance: 1%; Height max: 550µm; ComponentLink3URL: https://www.digikey.com/en/products/detail/yageo/RC0603FR-0722RL/727055; ComponentLink1URL: https://www.yageo.com/upload/media/product/productsearch/datasheet/rchip/PYu-RC_Group_51_RoHS_L_11.pdf
R3 R14 R15 R23 R27 R32 R33 = CMP-00465-3: RES SMD 10K OHM 0.5% 1/10W 0603; Manufacturer: YAGEO; Temperature Coefficient: ±25ppm; Op Temp max: 155°C; Power: 100mW; Op Temp min: -55°C; Height max: 550µm; MPN: RT0603DRD0710KL; Mounting Type: SM; ComponentLink1Description: Datasheet; ComponentLink3Description: Digikey; ComponentLink2URL: https://www.mouser.com/ProductDetail/YAGEO/RT0603DRD0710KL?qs=3wNGTxYkyxGtjvdxMGLloQ%3D%3D; ComponentLink2Description: Mouser; Package: 0603 (1608 Metric); ComponentLink3URL: https://www.digikey.com/en/products/detail/yageo/RT0603DRD0710KL/1035416; ComponentLink1URL: https://www.yageo.com/upload/media/product/productsearch/datasheet/rchip/PYu-RT_1-to-0.01_RoHS_L_12.pdf; Composition: Thin Film; Size: 1.60mm x 0.8mm; Ratings: -; Tolerance: 0.5%
R4 = CMP-001-0437-1: RES 75K OHM 1% 1/10W 0603; Manufacturer: YAGEO; Temperature Coefficient: ±150ppm; Power: 100mW; Op Temp max: 155°C; Op Temp min: -55°C; Ratings: -; ComponentLink2URL: https://eu.mouser.com/ProductDetail/YAGEO/RC0603FR-0775KL?qs=2cAdsCoAWRFA%2FpEX9%2F7xpw%3D%3D; Size: 1.60mm x 0.80mm; MPN: RC0603FR-0775KL; ComponentLink1Description: Datasheet; Mounting Type: SM; Composition: Thick Film; ComponentLink3Description: Digikey; Package: 0603 (1608 Metric); ComponentLink2Description: Mouser; Tolerance: 1%; Height max: 550µm; ComponentLink3URL: https://www.digikey.com/en/products/detail/yageo/RC0603FR-0775KL/727378; ComponentLink1URL: https://www.yageo.com/upload/media/product/productsearch/datasheet/rchip/PYu-RC_Group_51_RoHS_L_11.pdf
R5 R10 R17 R29 = CMP-001-0437-1: RES 100K OHM 1% 1/10W 0603; Manufacturer: YAGEO; Temperature Coefficient: ±150ppm; Power: 100mW; Op Temp max: 155°C; Op Temp min: -55°C; Ratings: -; ComponentLink2URL: https://eu.mouser.com/ProductDetail/YAGEO/RC0603FR-07100KL?qs=e1ok2LiJcmaihem8Va5%2Fsw%3D%3D; Size: 1.60mm x 0.80mm; MPN: RC0603FR-07100KL; ComponentLink1Description: Datasheet; Mounting Type: SM; Composition: Thick Film; ComponentLink3Description: Digikey; Package: 0603 (1608 Metric); ComponentLink2Description: Mouser; Tolerance: 1%; Height max: 550µm; ComponentLink3URL: https://www.digikey.com/en/products/detail/yageo/RC0603FR-07100KL/726889; ComponentLink1URL: https://www.yageo.com/upload/media/product/productsearch/datasheet/rchip/PYu-RC_Group_51_RoHS_L_11.pdf
R7 = CMP-001-0437-1: RES 24K OHM 1% 1/10W 0603; Manufacturer: YAGEO; Temperature Coefficient: ±150ppm; Power: 100mW; Op Temp max: 155°C; Op Temp min: -55°C; Ratings: -; ComponentLink2URL: https://eu.mouser.com/ProductDetail/YAGEO/RC0603FR-0724KL?qs=NUn4zLqw%2FjL4A5exBX9GHg%3D%3D; Size: 1.60mm x 0.80mm; MPN: RC0603FR-0724KL; ComponentLink1Description: Datasheet; Mounting Type: SM; Composition: Thick Film; ComponentLink3Description: Digikey; Package: 0603 (1608 Metric); ComponentLink2Description: Mouser; Tolerance: 1%; Height max: 550µm; ComponentLink3URL: https://www.digikey.com/en/products/detail/yageo/RC0603FR-0724KL/727076; ComponentLink1URL: https://www.yageo.com/upload/media/product/productsearch/datasheet/rchip/PYu-RC_Group_51_RoHS_L_11.pdf
R8 = CMP-001-0437-1: RES 33K OHM 1% 1/10W 0603; Manufacturer: YAGEO; Temperature Coefficient: ±150ppm; Power: 100mW; Op Temp max: 155°C; Op Temp min: -55°C; Ratings: -; ComponentLink2URL: https://eu.mouser.com/ProductDetail/YAGEO/RC0603FR-0733KL?qs=diQw95jMAeNLVoelhsKx3w%3D%3D; Size: 1.60mm x 0.80mm; MPN: RC0603FR-0733KL; ComponentLink1Description: Datasheet; Mounting Type: SM; Composition: Thick Film; ComponentLink3Description: Digikey; Package: 0603 (1608 Metric); ComponentLink2Description: Mouser; Tolerance: 1%; Height max: 550µm; ComponentLink3URL: https://www.digikey.com/en/products/detail/yageo/RC0603FR-0733KL/727159; ComponentLink1URL: https://www.yageo.com/upload/media/product/productsearch/datasheet/rchip/PYu-RC_Group_51_RoHS_L_11.pdf
R9 = CMP-001-0437-1: RES 300K OHM 1% 1/10W 0603; Manufacturer: YAGEO; Temperature Coefficient: ±150ppm; Power: 100mW; Op Temp max: 155°C; Op Temp min: -55°C; Ratings: -; ComponentLink2URL: https://eu.mouser.com/ProductDetail/YAGEO/RC0603FR-07300KL?qs=diQw95jMAeNfdIj8TA3yIQ%3D%3D; Size: 1.60mm x 0.80mm; MPN: RC0603FR-07300KL; ComponentLink1Description: Datasheet; Mounting Type: SM; Composition: Thick Film; ComponentLink3Description: Digikey; Package: 0603 (1608 Metric); ComponentLink2Description: Mouser; Tolerance: 1%; Height max: 550µm; ComponentLink3URL: https://www.digikey.com/en/products/detail/yageo/RC0603FR-07300KL/727145; ComponentLink1URL: https://www.yageo.com/upload/media/product/productsearch/datasheet/rchip/PYu-RC_Group_51_RoHS_L_11.pdf
R12 = CMP-001-0437-1: RES 15K OHM 1% 1/10W 0603; Manufacturer: YAGEO; Temperature Coefficient: ±150ppm; Power: 100mW; Op Temp max: 155°C; Op Temp min: -55°C; Ratings: -; ComponentLink2URL: https://eu.mouser.com/ProductDetail/YAGEO/RC0603FR-0715KL?qs=VU8sRB4EgwBhsSCK0A%252BW%252Bw%3D%3D; Size: 1.60mm x 0.80mm; MPN: RC0603FR-0715KL; ComponentLink1Description: Datasheet; Mounting Type: SM; Composition: Thick Film; ComponentLink3Description: Digikey; Package: 0603 (1608 Metric); ComponentLink2Description: Mouser; Tolerance: 1%; Height max: 550µm; ComponentLink3URL: https://www.digikey.com/en/products/detail/yageo/RC0603FR-0715KL/726953; ComponentLink1URL: https://www.yageo.com/upload/media/product/productsearch/datasheet/rchip/PYu-RC_Group_51_RoHS_L_11.pdf
R13 = CMP-001-0440-1: RES SMD 4.7K OHM 1% 1/10W 0603; Manufacturer: YAGEO; Op Temp max: 155°C; Temperature Coefficient: ±150ppm; Op Temp min: -55°C; Power: 100mW; Height max: 550µm; Package: 0603 (1608 Metric); ComponentLink2URL: https://eu.mouser.com/ProductDetail/YAGEO/RC0603FR-074K7P?qs=oypCK0zG327zAS2t0a3YLw%3D%3D; Ratings: -; Mounting Type: SM; Tolerance: 1%; ComponentLink3Description: Digikey; Composition: Thick Film; MPN: RC0603FR-074K7P; ComponentLink2Description: Mouser; ComponentLink1Description: Datasheet; ComponentLink3URL: https://www.digikey.com/en/products/detail/yageo/RC0603FR-074K7P/4935319; ComponentLink1URL: https://www.yageo.com/upload/media/product/productsearch/datasheet/rchip/PYu-RC_51_RoHS_P_2.pdf; Size: 1.60mm x 0.80mm
R16 = CMP-001-0437-1: RES 47K OHM 1% 1/10W 0603; Manufacturer: YAGEO; Temperature Coefficient: ±150ppm; Power: 100mW; Op Temp max: 155°C; Op Temp min: -55°C; Ratings: -; ComponentLink2URL: https://eu.mouser.com/ProductDetail/YAGEO/RC0603FR-0747KL?qs=gt6vzsuosg3jXzmCiDCCdg%3D%3D; Size: 1.60mm x 0.80mm; MPN: RC0603FR-0747KL; ComponentLink1Description: Datasheet; Mounting Type: SM; Composition: Thick Film; ComponentLink3Description: Digikey; Package: 0603 (1608 Metric); ComponentLink2Description: Mouser; Tolerance: 1%; Height max: 550µm; ComponentLink3URL: https://www.digikey.com/en/products/detail/yageo/RC0603FR-0747KL/727253; ComponentLink1URL: https://www.yageo.com/upload/media/product/productsearch/datasheet/rchip/PYu-RC_Group_51_RoHS_L_11.pdf
R18 R30 = CMP-001-0440-1: RES 5.1K OHM 1% 1/10W 0603; Manufacturer: YAGEO; Op Temp max: 155°C; Temperature Coefficient: ±100ppm; Op Temp min: -55°C; Power: 100mW; Height max: 550µm; Package: 0603 (1608 Metric); ComponentLink2URL: https://eu.mouser.com/ProductDetail/YAGEO/RC0603FR-075K1L?qs=gt6vzsuosg2jUUwxnI2PJQ%3D%3D; Ratings: -; Mounting Type: SM; Tolerance: 1%; ComponentLink3Description: Digikey; Composition: Thick Film; MPN: RC0603FR-075K1L; ComponentLink2Description: Mouser; ComponentLink1Description: Datasheet; ComponentLink3URL: https://www.digikey.com/en/products/detail/yageo/RC0603FR-075K1L/727268; ComponentLink1URL: https://www.yageo.com/upload/media/product/productsearch/datasheet/rchip/PYu-RC_Group_51_RoHS_L_11.pdf; Size: 1.60mm x 0.80mm
R19 R20 R22 R24 R28 = CMP-001-0437-1: RES SMD 1K OHM 1% 1/10W 0603; Manufacturer: YAGEO; Temperature Coefficient: ±150ppm; Power: 100mW; Op Temp max: 155°C; Op Temp min: -55°C; Ratings: -; ComponentLink2URL: https://eu.mouser.com/ProductDetail/YAGEO/RC0603FR-071KP?qs=oypCK0zG325Qk9R53mztcw%3D%3D; Size: 1.60mm x 0.80mm; MPN: RC0603FR-071KP; ComponentLink1Description: Datasheet; Mounting Type: SM; Composition: Thick Film; ComponentLink3Description: Digikey; Package: 0603 (1608 Metric); ComponentLink2Description: Mouser; Tolerance: 1%; Height max: 550µm; ComponentLink3URL: https://www.digikey.com/en/products/detail/yageo/RC0603FR-071KP/4935309; ComponentLink1URL: https://www.yageo.com/upload/media/product/productsearch/datasheet/rchip/PYu-RC_51_RoHS_P_2.pdf
R21 = CMP-001-0437-1: RES 2.4K OHM 1% 1/10W 0603; Manufacturer: YAGEO; Temperature Coefficient: ±150ppm; Power: 100mW; Op Temp max: 155°C; Op Temp min: -55°C; Ratings: -; ComponentLink2URL: https://eu.mouser.com/ProductDetail/YAGEO/RC0603FR-072K4L?qs=0yPvnVz5%2FmrC6p3yyBfpHw%3D%3D; Size: 1.60mm x 0.80mm; MPN: RC0603FR-072K4L; ComponentLink1Description: Datasheet; Mounting Type: SM; Composition: Thick Film; ComponentLink3Description: Digikey; Package: 0603 (1608 Metric); ComponentLink2Description: Mouser; Tolerance: 1%; Height max: 550µm; ComponentLink3URL: https://www.digikey.com/en/products/detail/yageo/RC0603FR-072K4L/727023; ComponentLink1URL: https://www.yageo.com/upload/media/product/productsearch/datasheet/rchip/PYu-RC_Group_51_RoHS_L_11.pdf
R25 = CMP-001-0215-7: RES SMD 1M OHM 1% 1/10W 0603; Manufacturer: YAGEO; Op Temp max: 155°C; Temperature Coefficient: ±100ppm; Power: 100mW; Op Temp min: -55°C; Tolerance: 1%; ComponentLink2Description: Mouser; Height max: 550µm; Composition: Thick Film; Size: 1.60mm x 0.80mm; Package: 0603 (1608 Metric); Mounting Type: SM; ComponentLink2URL: https://eu.mouser.com/ProductDetail/YAGEO/AC0603FR-071ML?qs=%2Fha2pyFadujj9sgtHXfPQkikAa9GKG5jA2OI%2FEJb2fnr%2FnJ%2FqTHQyA%3D%3D; ComponentLink1URL: https://www.yageo.com/upload/media/product/productsearch/datasheet/rchip/PYu-AC_51_RoHS_L_7.pdf; MPN: AC0603FR-071ML; Ratings: AEC-Q200; ComponentLink3URL: https://www.digikey.com/en/products/detail/yageo/AC0603FR-071ML/2827820?s=N4IgTCBcDaIIIGEAMA2JBmAYgJQLRIHYBGAWQBkQBdAXyA; ComponentLink1Description: Datasheet; ComponentLink3Description: Digikey
R26 = CMP-001-0222-5: RES SMD 0 OHM JUMPER 1/10W 0603; Manufacturer: Vishay Dale; Tolerance: 0%; Op Temp min: -55°C; Op Temp max: 155°C; Power: 100mW; ComponentLink1URL: https://www.vishay.com/docs/20035/dcrcwe3.pdf; Composition: Thick Film; ComponentLink3URL: https://www.digikey.com/en/products/detail/vishay-dale/CRCW06030000Z0EA/1174156; Height max: 500µm; ComponentLink1Description: Datasheet; Size: 1.60mm x 0.85mm; ComponentLink2Description: Mouser; Temperature Coefficient: -; Mounting Type: SM; ComponentLink2URL: https://eu.mouser.com/ProductDetail/Vishay-Dale/CRCW06030000Z0EA?qs=uFJqmf%2F3rbbVtxvMdbYUaQ%3D%3D; Package: 0603 (1608 Metric); Ratings: AEC-Q200; ComponentLink3Description: Digikey; MPN: CRCW06030000Z0EA
R31 = CMP-001-0440-1: RES 330 OHM 1% 1/10W 0603; Manufacturer: YAGEO; Op Temp max: 155°C; Temperature Coefficient: ±100ppm; Op Temp min: -55°C; Power: 100mW; Height max: 550µm; Package: 0603 (1608 Metric); ComponentLink2URL: https://eu.mouser.com/ProductDetail/YAGEO/RC0603FR-07330RL?qs=diQw95jMAeN1335dAOzMfg%3D%3D; Ratings: -; Mounting Type: SM; Tolerance: 1%; ComponentLink3Description: Digikey; Composition: Thick Film; MPN: RC0603FR-07330RL; ComponentLink2Description: Mouser; ComponentLink1Description: Datasheet; ComponentLink3URL: https://www.digikey.com/en/products/detail/yageo/RC0603FR-07330RL/727162?s=N4IgTCBcDaIEoGEAMA2JBmAYnAtEg7OuknADIgC6AvkA; ComponentLink1URL: https://www.yageo.com/upload/media/product/productsearch/datasheet/rchip/PYu-RC_Group_51_RoHS_L_11.pdf; Size: 1.60mm x 0.80mm
S1 = PB400EEQX: Pushbutton Switch DPST Standard Through Hole, Right Angle; Manufacturer: E-Switch; MPN: PB400EEQX
S2 S3 = 436351045816: Tactile Switch SPST-NO Side Actuated Surface Mount, Right Angle; Manufacturer: Wurth Elektronik; MPN: 436351045816
TP1-TP12 = TPAD: Test Pad, SMD; Group: Test point
U1 = M138_MODEM: 'SWARM M138 MODEM mPCIe 2.005" (50.925mm) x 1.18" (30mm)  Two part connector; Manufacturer: Swarm; MPN: A: MM60-52B1-B1-R850 B: MM60-EZH039-B5-R850
U2 = RT8070ZQW: IC REG BUCK ADJUSTABLE 4A 8WDFN; Manufacturer: Richtek USA Inc.; Voltage - Input (Min): 2.7V; Voltage - Input (Max): 5.5V; Voltage - Output (Min/Fixed): 0.8V; Voltage - Output (Max): 5V; Frequency - Switching: 200kHz ~ 2MHz; ComponentLink1Description: Datasheet; ComponentLink1URL: https://www.richtek.com/assets/product_file/RT8070/DS8070-09.pdf; ComponentLink2Description: Digikey; ComponentLink2URL: https://www.digikey.com/en/products/detail/richtek-usa-inc/RT8070ZQW/3078331; MPN: RT8070ZQW; Current - Output: 4A; Package / Case: 8-WDFN Exposed Pad
U3 = MCP73831-2-OT: IC BATT CNTL LI-ION 1CEL SOT23-5; Generic Part: no; Manufacturer: Microchip Technology; MPN: MCP73831T-2ACI/OT; Footprint: Package_TO_SOT_SMD:SOT-23-5; LCSC Part Number: *
U4 = ESP32-C3-MINI-1-N4: Bluetooth, WiFi 802.11b/g/n, Bluetooth v5.0 Transceiver Module 2.412GHz ~ 2.484GHz PCB Trace Surface Mount; Manufacturer: Espressif Systems; Purchase-URL: https://pricing.snapeda.com/search/part/ESP32-C3-MINI-1-N4/?ref=eda; Value: *; Package: SMD-53 Espressif Systems; Check_prices: https://www.snapeda.com/parts/ESP32-C3-MINI-1-N4/Espressif+Systems/view-part/?ref=eda; Price: None; Availability: In Stock; MPN: ESP32-C3-MINI-1-N4; SnapEDA_Link: https://www.snapeda.com/parts/ESP32-C3-MINI-1-N4/Espressif+Systems/view-part/?ref=snap
U5 = SN74LVC1G04DBVR: Inverter IC 1 Channel - SOT-23-5; Manufacturer: Texas Instruments; Datasheet Link: http://www.ti.com/lit/gpn/sn74lvc1g04; Height: 1.45mm; Arrow Part Number: SN74LVC1G04DBVR; Arrow Price/Stock: https://www.arrow.com/en/products/sn74lvc1g04dbvr/texas-instruments; Mouser Part Number: 595-SN74LVC1G04DBVR; Mouser Price/Stock: https://www.mouser.co.uk/ProductDetail/Texas-Instruments/SN74LVC1G04DBVR?qs=AMJt07B76utiScZvQx5a7w%3D%3D; LCSC Part Number: C7827; MPN: SN74LVC1G04DBVR
Y1 = ABS07-32.768KHZ-T: 32.768kHz Â±20ppm Crystal 12.5pF 70 kOhms 2-SMD, No Lead; Manufacturer: Abracon LLC; Price: None; Value: *; Package: SMD-2 Abracon; Availability: Unavailable; SnapEDA_Link: https://www.snapeda.com/parts/ABS07-32.768KHZ/Abracon%20LLC/view-part/448682/?ref=snap; MPN: ABS07-32.768KHZ